# Altium project FanoutTest.PrjPcb
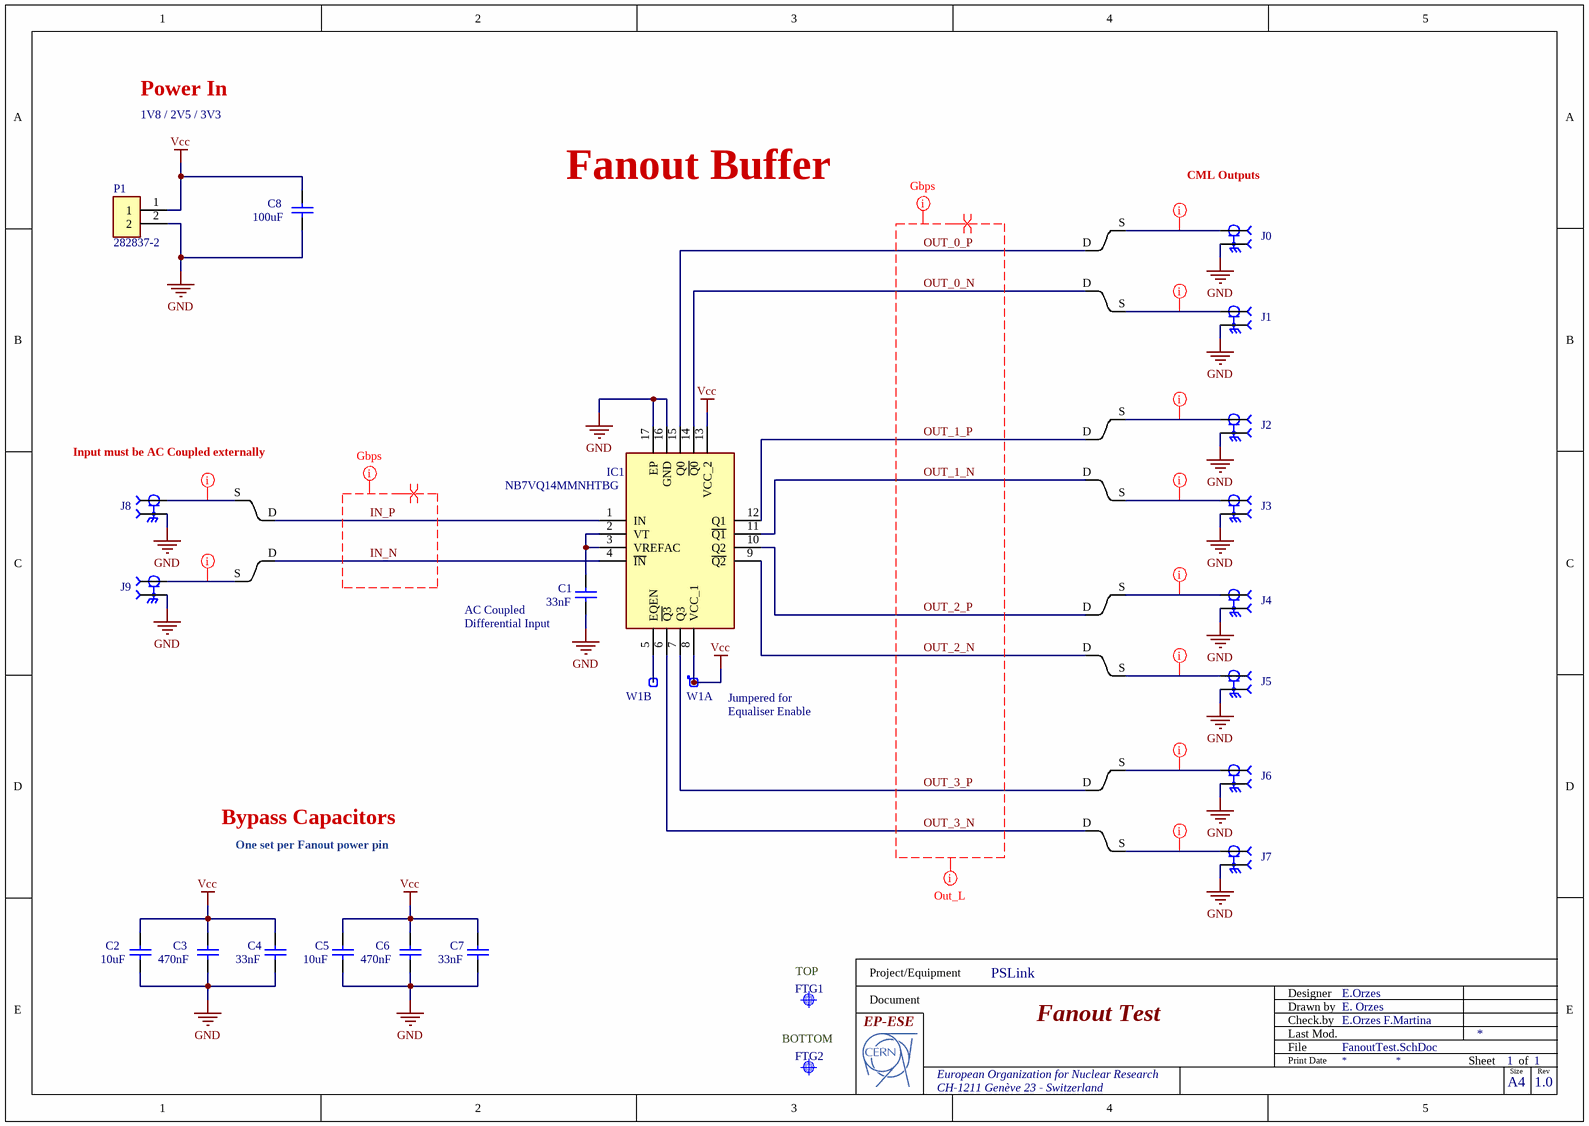
[diagram p0: FanoutTest.SchDoc]
Project: CDR Test Coupon
1 sheet, 33 parts. Net scope: global (net labels, ports and power ports of the same name join across sheets).
Board file: FanoutTest.PcbDoc

## Sheet FanoutTest.SchDoc: Fanout Test
size 297 x 209 mm; CheckedBy: E.Orzes F.Martina; CompanyName: CERN; DrawnBy: E. Orzes; Organization: CERN; Address1: European Organization for Nuclear Research; Address2: CH-1211 Genève 23 - Switzerland; Revision: 1.0; SheetNumber: 1; SheetTotal: 1; Projet: PSLink; DivGrp: EP-ESE; Designer: E.Orzes

### Parts
C1  33nF  [LLL03TR61E333KE01]
C2  10uF  [CAPC1608X87N]
C3  470nF  [CAPC0510X04N]
C4  33nF  [LLL03TR61E333KE01]
C5  10uF  [CAPC1608X87N]
C6  470nF  [CAPC0510X04N]
C7  33nF  [LLL03TR61E333KE01]
C8  100uF  [CAPC3225X270N]
FTG1  Use only in PCB  [FIDUCIAL_TOP_C100-200]  (value not drawn)
FTG2  Use only in PCB  [FIDUCIAL_TOP_C100-200]  (value not drawn)
IC1  NB7VQ14MMNHTBG  [QFN50P300X300X100-17N]
J0  SMA  [CONSMA022-G]  (value not drawn)
J1  SMA  [CONSMA022-G]  (value not drawn)
J2  SMA  [CONSMA022-G]  (value not drawn)
J3  SMA  [CONSMA022-G]  (value not drawn)
J4  SMA  [CONSMA022-G]  (value not drawn)
J5  SMA  [CONSMA022-G]  (value not drawn)
J6  SMA  [CONSMA022-G]  (value not drawn)
J7  SMA  [CONSMA022-G]  (value not drawn)
J8  SMA  [CONSMA022-G]  (value not drawn)
J9  SMA  [CONSMA022-G]  (value not drawn)
P1  282837-2  [TE_282837-2]
TA1  Differential to Single Transition  [lane_width_transition]  (value not drawn)  (net tie, no BOM)
TA2  Differential to Single Transition  [lane_width_transition]  (value not drawn)  (net tie, no BOM)
TA3  Differential to Single Transition  [lane_width_transition]  (value not drawn)  (net tie, no BOM)
TA4  Differential to Single Transition  [lane_width_transition]  (value not drawn)  (net tie, no BOM)
TA5  Differential to Single Transition  [lane_width_transition]  (value not drawn)  (net tie, no BOM)
TA6  Differential to Single Transition  [lane_width_transition]  (value not drawn)  (net tie, no BOM)
TA7  Differential to Single Transition  [lane_width_transition]  (value not drawn)  (net tie, no BOM)
TA8  Differential to Single Transition  [lane_width_transition]  (value not drawn)  (net tie, no BOM)
TA9  Differential to Single Transition  [lane_width_transition]  (value not drawn)  (net tie, no BOM)
TA10  Differential to Single Transition  [lane_width_transition]  (value not drawn)  (net tie, no BOM)
W1  Header 2  [SAMTEC_HTSW-102-23-L-S]  (value not drawn)  (parts A,B of 2)

### Nets
GND: C1.1 C2.1 C3.1 C4.1 C5.1 C6.1 C7.1 C8.1 IC1.16(GND) IC1.17(EP) J0.0(GND) J1.0(GND) J2.0(GND) J3.0(GND) J4.0(GND) J5.0(GND) J6.0(GND) J7.0(GND) J8.0(GND) J9.0(GND) P1.2
Vcc: C2.2 C3.2 C4.2 C5.2 C6.2 C7.2 C8.2 IC1.8(VCC_1) IC1.13(VCC_2) P1.1 W1.1
IN_N: IC1.4(~{IN}) TA6.D
IN_P: IC1.1(IN) TA4.D
OUT_0_N: IC1.14(~{Q0}) TA2.D
OUT_0_P: IC1.15(Q0) TA1.D
OUT_1_N: IC1.11(~{Q1}) TA5.D
OUT_1_P: IC1.12(Q1) TA3.D
OUT_2_N: IC1.9(~{Q2}) TA8.D
OUT_2_P: IC1.10(Q2) TA7.D
OUT_3_N: IC1.6(~{Q3}) TA10.D
OUT_3_P: IC1.7(Q3) TA9.D
NetC1_2: C1.2 IC1.2(VT) IC1.3(VREFAC)
NetIC1_5: IC1.5(EQEN) W1.2
NetJ0_1: J0.1(S) TA1.S
NetJ1_1: J1.1(S) TA2.S
NetJ2_1: J2.1(S) TA3.S
NetJ3_1: J3.1(S) TA5.S
NetJ4_1: J4.1(S) TA7.S
NetJ5_1: J5.1(S) TA8.S
NetJ6_1: J6.1(S) TA9.S
NetJ7_1: J7.1(S) TA10.S
NetJ8_1: J8.1(S) TA4.S
NetJ9_1: J9.1(S) TA6.S

### Layout directives
differential pair: IN_N, IN_P, OUT_0_N, OUT_0_P, OUT_1_N, OUT_1_P, OUT_2_N, OUT_2_P, OUT_3_N, OUT_3_P
mark named Gbps: IN_N, IN_P, OUT_0_N, OUT_0_P, OUT_1_N, OUT_1_P, OUT_2_N, OUT_2_P, OUT_3_N, OUT_3_P
net class 50ohm: NetJ0_1, NetJ1_1, NetJ2_1, NetJ3_1, NetJ4_1, NetJ5_1, NetJ6_1, NetJ7_1, NetJ8_1, NetJ9_1
net class Output_Lanes: OUT_0_N, OUT_0_P, OUT_1_N, OUT_1_P, OUT_2_N, OUT_2_P, OUT_3_N, OUT_3_P

### Notes on the sheet
- Power In
- 1V8 / 2V5 / 3V3
- Fanout Buffer
- (near J0) CML Outputs
- Input must be AC Coupled externally
- (near C1) AC Coupled
  Differential Input
- (near W1) Jumpered for Equaliser Enable
- Bypass Capacitors
- One set per Fanout power pin
- (near FTG1) TOP
- BOTTOM
- Project/Equipment
- Document
- Designer
- Drawn by
- Check.by
- File
- Last Mod.
- Print Date
- Sheet
- Size
- A4
- of
- Rev

### Library data of the parts
C1 C4 C7 = Capacitor - non polarized: LLL03TR61E333KE01; Value: 33nF
C2 C5 = CC0603_10UF_6.3V_20%_X5R: GRM188D71A106KA73; Part Description: SMD Multilayer Chip Ceramic Capacitor; Manufacturer: GENERIC; Manufacturer1 Part Number: C0603C106M9PAC; Voltage: 6.3V; TC: X5R; Tolerance: ±20%; Part Number: CC0603_10UF_6.3V_20%_X5R; Component Kind: Standard; Component Type: Standard; Pin Count: 2; Value: 10uF; Status: Preferred; Manufacturer Part Number: CC0603_10uF_6.3V_20%_X5R; Case: 0603; Mounted: Yes; Socket: No; SMD: Yes; Sense: No; Manufacturer1 Example: KEMET; Manufacturer1 ComponentHeight: 0.95mm; HelpURL: \\cern.ch\dfs\Applications\Altium\Datasheets\CC0603_X5R_KEMET.pdf; Author: CERN DEM JLC; CreateDate: 03/12/2007; LatestRevisionDate: 03/12/2007
C3 C6 = Capacitor - non polarized: LLL153C70G474ME17; Value: 470nF
C8 = CC1210_100UF_6.3V_20%_X7U: GRM32EC70J107ME15; Part Description: SMD Multilayer Chip Ceramic Capacitor; Manufacturer: GENERIC; Manufacturer1 Part Number: GRM32EE70J107ME15L; Voltage: 6.3V; TC: X7U; Tolerance: ±20%; Part Number: CC1210_100UF_6.3V_20%_X7U; Component Kind: Standard; Component Type: Standard; Pin Count: 2; Value: 100uF; Status: None; Manufacturer Part Number: CC1210_100UF_6.3V_20%_X7U; Case: 1210; Mounted: Yes; Socket: No; SMD: Yes; Sense: No; Manufacturer1 Example: MURATA; Manufacturer1 ComponentHeight: 2.7mm; HelpURL: \\cern.ch\dfs\Applications\Altium\Datasheets\CC1210_X7U_MURATA.pdf; Author: CERN DEM MR; CreateDate: 10/12/2017; LatestRevisionDate: 10/12/2017
FTG1 FTG2 = FIDUCIAL_TARGET_C100-200: Fiducial Target; Part Description: Round Fiducial Target, Top Layer, 1.0mm, Top Solder 2.0mm, Keepout =2.0mm; Mounted: No; Part Number: FIDUCIAL_TARGET_C100-200; Component Kind: Standard (No BOM); Component Type: Standard (No BOM); Pin Count: 1; Family: Fiducial; Socket: No; SMD: Yes; Sense: No; Status: None; ComponentHeight: 0mm; HelpURL: Undefined; Author: CERN DEM JLC; CreateDate: 09/02/2010; LatestRevisionDate: 04/04/2012; PackageDescription: Round Fiducial Target, Top Layer, 1.0mm, Top Solder 2.0mm, Keepout =2.0mm
IC1 = NB7VQ14MMNHTBG: Integrated Circuit; Manufacturer_Name: onsemi; Datasheet Link: http://www.onsemi.com/pub/Collateral/NB7VQ14M-D.PDF; Height: 1mm; Manufacturer_Part_Number: NB7VQ14MMNHTBG; Mouser Part Number: 863-NB7VQ14MMNHTBG; Mouser Price/Stock: https://www.mouser.co.uk/ProductDetail/onsemi/NB7VQ14MMNHTBG?qs=3PKVEWFFm2%2FWq%2FFZ4xstfg%3D%3D; Arrow Part Number: NB7VQ14MMNHTBG; Arrow Price/Stock: https://www.arrow.com/en/products/nb7vq14mmnhtbg/on-semiconductor?utm_currency=USD&region=nac
P1 = 282837-2: MF: TE Connectivity; SnapEDA_Link: https://www.snapeda.com/parts/282837-2/TE+Connectivity+AMP+Connectors/view-part/?ref=snap; Price: None; Check_prices: https://www.snapeda.com/parts/282837-2/TE+Connectivity+AMP+Connectors/view-part/?ref=eda; Purchase-URL: https://pricing.snapeda.com/search/part/282837-2/?ref=eda; MP: 282837-2; Value: *; Availability: In Stock; Package: None
TA1-TA10 = lane_width_transition
W1 = SAMTEC_HTSW-102-23-L-S: 2 Mini Wire-Wrap Contact Strip Header; Part Description: 2 Contacts, Pitch 2.54mm, Single Row  Through Mount Straight Header (Post Lead 5.84mm, Tail Lead 2.92mm, Insulator 2.54mm); Manufacturer: SAMTEC; PressFit: No; Status Comment: High Temperature; Part Number: SAMTEC_HTSW-102-23-L-S; Component Kind: Standard; Component Type: Standard; Pin Count: 2; Family: Header 2; Mounted: Yes; Socket: No; SMD: No; Sense: No; Status: Preferred; Manufacturer Part Number: HTSW-102-23-L-S; ComponentHeight: 8.38mm; HelpURL: \\cern.ch\dfs\Applications\Altium\Datasheets\SAMTEC_HTSW-102-23-L-S.pdf; Author: CERN DEM JLC; CreateDate: 2/22/2018; LatestRevisionDate: 2/22/2018